# Altium project Project-C_VOLTAGE.PrjPCB (part 3 of 6)
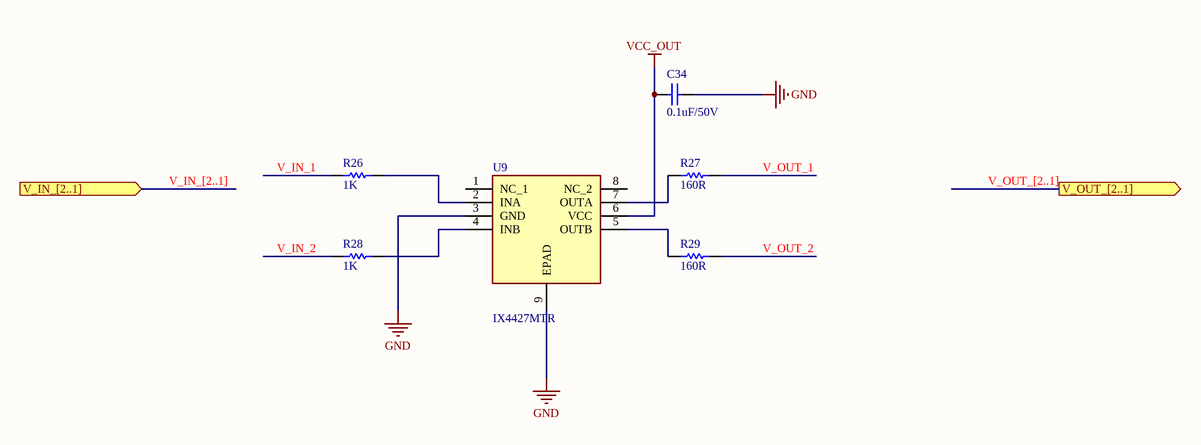
[diagram p10: VoltageAmplifier.SchDoc]
## Nets that join several sheets
GND: TOP_VOLTAGE (26 pins), F1/IO (19 pins), F1/POWER (42 pins), VoltageHeaders (20 pins), POWER_VOLTAGE (32 pins), F2/IO (19 pins), F2/POWER (42 pins), F3/IO (19 pins), F3/POWER (42 pins), F4/IO (19 pins), F4/POWER (42 pins), Power_ORing (14 pins), U_VoltageAmplifier_1xFPGA1/U_VoltageAmplifier1 (C34_U_VoltageAmplifier_1xFPGA1_U_VoltageAmplifier1.2 U9_U_VoltageAmplifier_1xFPGA1_U_VoltageAmplifier1.3 U9_U_VoltageAmplifier_1xFPGA1_U_VoltageAmplifier1.9), U_VoltageAmplifier_1xFPGA1/U_VoltageAmplifier2 (C34_U_VoltageAmplifier_1xFPGA1_U_VoltageAmplifier2.2 U9_U_VoltageAmplifier_1xFPGA1_U_VoltageAmplifier2.3 U9_U_VoltageAmplifier_1xFPGA1_U_VoltageAmplifier2.9), U_VoltageAmplifier_1xFPGA1/U_VoltageAmplifier3 (C34_U_VoltageAmplifier_1xFPGA1_U_VoltageAmplifier3.2 U9_U_VoltageAmplifier_1xFPGA1_U_VoltageAmplifier3.3 U9_U_VoltageAmplifier_1xFPGA1_U_VoltageAmplifier3.9), U_VoltageAmplifier_1xFPGA1/U_VoltageAmplifier4 (C34_U_VoltageAmplifier_1xFPGA1_U_VoltageAmplifier4.2 U9_U_VoltageAmplifier_1xFPGA1_U_VoltageAmplifier4.3 U9_U_VoltageAmplifier_1xFPGA1_U_VoltageAmplifier4.9), U_VoltageAmplifier_1xFPGA1/U_VoltageAmplifier5 (C34_U_VoltageAmplifier_1xFPGA1_U_VoltageAmplifier5.2 U9_U_VoltageAmplifier_1xFPGA1_U_VoltageAmplifier5.3 U9_U_VoltageAmplifier_1xFPGA1_U_VoltageAmplifier5.9), U_VoltageAmplifier_1xFPGA1/U_VoltageAmplifier6 (C34_U_VoltageAmplifier_1xFPGA1_U_VoltageAmplifier6.2 U9_U_VoltageAmplifier_1xFPGA1_U_VoltageAmplifier6.3 U9_U_VoltageAmplifier_1xFPGA1_U_VoltageAmplifier6.9), U_VoltageAmplifier_1xFPGA1/U_VoltageAmplifier7 (C34_U_VoltageAmplifier_1xFPGA1_U_VoltageAmplifier7.2 U9_U_VoltageAmplifier_1xFPGA1_U_VoltageAmplifier7.3 U9_U_VoltageAmplifier_1xFPGA1_U_VoltageAmplifier7.9), U_VoltageAmplifier_1xFPGA1/U_VoltageAmplifier8 (C34_U_VoltageAmplifier_1xFPGA1_U_VoltageAmplifier8.2 U9_U_VoltageAmplifier_1xFPGA1_U_VoltageAmplifier8.3 U9_U_VoltageAmplifier_1xFPGA1_U_VoltageAmplifier8.9), U_VoltageAmplifier_1xFPGA1/U_VoltageAmplifier9 (C34_U_VoltageAmplifier_1xFPGA1_U_VoltageAmplifier9.2 U9_U_VoltageAmplifier_1xFPGA1_U_VoltageAmplifier9.3 U9_U_VoltageAmplifier_1xFPGA1_U_VoltageAmplifier9.9), U_VoltageAmplifier_1xFPGA1/U_VoltageAmplifier10 (C34_U_VoltageAmplifier_1xFPGA1_U_VoltageAmplifier10.2 U9_U_VoltageAmplifier_1xFPGA1_U_VoltageAmplifier10.3 U9_U_VoltageAmplifier_1xFPGA1_U_VoltageAmplifier10.9), U_VoltageAmplifier_1xFPGA1/U_VoltageAmplifier11 (C34_U_VoltageAmplifier_1xFPGA1_U_VoltageAmplifier11.2 U9_U_VoltageAmplifier_1xFPGA1_U_VoltageAmplifier11.3 U9_U_VoltageAmplifier_1xFPGA1_U_VoltageAmplifier11.9), U_VoltageAmplifier_1xFPGA1/U_VoltageAmplifier12 (C34_U_VoltageAmplifier_1xFPGA1_U_VoltageAmplifier12.2 U9_U_VoltageAmplifier_1xFPGA1_U_VoltageAmplifier12.3 U9_U_VoltageAmplifier_1xFPGA1_U_VoltageAmplifier12.9), U_VoltageAmplifier_1xFPGA1/U_VoltageAmplifier13 (C34_U_VoltageAmplifier_1xFPGA1_U_VoltageAmplifier13.2 U9_U_VoltageAmplifier_1xFPGA1_U_VoltageAmplifier13.3 U9_U_VoltageAmplifier_1xFPGA1_U_VoltageAmplifier13.9), U_VoltageAmplifier_1xFPGA1/U_VoltageAmplifier14 (C34_U_VoltageAmplifier_1xFPGA1_U_VoltageAmplifier14.2 U9_U_VoltageAmplifier_1xFPGA1_U_VoltageAmplifier14.3 U9_U_VoltageAmplifier_1xFPGA1_U_VoltageAmplifier14.9), U_VoltageAmplifier_1xFPGA1/U_VoltageAmplifier15 (C34_U_VoltageAmplifier_1xFPGA1_U_VoltageAmplifier15.2 U9_U_VoltageAmplifier_1xFPGA1_U_VoltageAmplifier15.3 U9_U_VoltageAmplifier_1xFPGA1_U_VoltageAmplifier15.9), U_VoltageAmplifier_1xFPGA1/U_VoltageAmplifier16 (C34_U_VoltageAmplifier_1xFPGA1_U_VoltageAmplifier16.2 U9_U_VoltageAmplifier_1xFPGA1_U_VoltageAmplifier16.3 U9_U_VoltageAmplifier_1xFPGA1_U_VoltageAmplifier16.9), U_VoltageAmplifier_1xFPGA1/U_VoltageAmplifier17 (C34_U_VoltageAmplifier_1xFPGA1_U_VoltageAmplifier17.2 U9_U_VoltageAmplifier_1xFPGA1_U_VoltageAmplifier17.3 U9_U_VoltageAmplifier_1xFPGA1_U_VoltageAmplifier17.9), U_VoltageAmplifier_1xFPGA1/U_VoltageAmplifier18 (C34_U_VoltageAmplifier_1xFPGA1_U_VoltageAmplifier18.2 U9_U_VoltageAmplifier_1xFPGA1_U_VoltageAmplifier18.3 U9_U_VoltageAmplifier_1xFPGA1_U_VoltageAmplifier18.9), U_VoltageAmplifier_1xFPGA1/U_VoltageAmplifier19 (C34_U_VoltageAmplifier_1xFPGA1_U_VoltageAmplifier19.2 U9_U_VoltageAmplifier_1xFPGA1_U_VoltageAmplifier19.3 U9_U_VoltageAmplifier_1xFPGA1_U_VoltageAmplifier19.9), U_VoltageAmplifier_1xFPGA1/U_VoltageAmplifier20 (C34_U_VoltageAmplifier_1xFPGA1_U_VoltageAmplifier20.2 U9_U_VoltageAmplifier_1xFPGA1_U_VoltageAmplifier20.3 U9_U_VoltageAmplifier_1xFPGA1_U_VoltageAmplifier20.9), U_VoltageAmplifier_1xFPGA1/U_VoltageAmplifier21 (C34_U_VoltageAmplifier_1xFPGA1_U_VoltageAmplifier21.2 U9_U_VoltageAmplifier_1xFPGA1_U_VoltageAmplifier21.3 U9_U_VoltageAmplifier_1xFPGA1_U_VoltageAmplifier21.9), U_VoltageAmplifier_1xFPGA1/U_VoltageAmplifier22 (C34_U_VoltageAmplifier_1xFPGA1_U_VoltageAmplifier22.2 U9_U_VoltageAmplifier_1xFPGA1_U_VoltageAmplifier22.3 U9_U_VoltageAmplifier_1xFPGA1_U_VoltageAmplifier22.9), U_VoltageAmplifier_1xFPGA1/U_VoltageAmplifier23 (C34_U_VoltageAmplifier_1xFPGA1_U_VoltageAmplifier23.2 U9_U_VoltageAmplifier_1xFPGA1_U_VoltageAmplifier23.3 U9_U_VoltageAmplifier_1xFPGA1_U_VoltageAmplifier23.9), U_VoltageAmplifier_1xFPGA1/U_VoltageAmplifier24 (C34_U_VoltageAmplifier_1xFPGA1_U_VoltageAmplifier24.2 U9_U_VoltageAmplifier_1xFPGA1_U_VoltageAmplifier24.3 U9_U_VoltageAmplifier_1xFPGA1_U_VoltageAmplifier24.9), U_VoltageAmplifier_1xFPGA1/U_VoltageAmplifier25 (C34_U_VoltageAmplifier_1xFPGA1_U_VoltageAmplifier25.2 U9_U_VoltageAmplifier_1xFPGA1_U_VoltageAmplifier25.3 U9_U_VoltageAmplifier_1xFPGA1_U_VoltageAmplifier25.9), U_VoltageAmplifier_1xFPGA1/U_VoltageAmplifier26 (C34_U_VoltageAmplifier_1xFPGA1_U_VoltageAmplifier26.2 U9_U_VoltageAmplifier_1xFPGA1_U_VoltageAmplifier26.3 U9_U_VoltageAmplifier_1xFPGA1_U_VoltageAmplifier26.9), U_VoltageAmplifier_1xFPGA1/U_VoltageAmplifier27 (C34_U_VoltageAmplifier_1xFPGA1_U_VoltageAmplifier27.2 U9_U_VoltageAmplifier_1xFPGA1_U_VoltageAmplifier27.3 U9_U_VoltageAmplifier_1xFPGA1_U_VoltageAmplifier27.9), U_VoltageAmplifier_1xFPGA1/U_VoltageAmplifier28 (C34_U_VoltageAmplifier_1xFPGA1_U_VoltageAmplifier28.2 U9_U_VoltageAmplifier_1xFPGA1_U_VoltageAmplifier28.3 U9_U_VoltageAmplifier_1xFPGA1_U_VoltageAmplifier28.9), U_VoltageAmplifier_1xFPGA1/U_VoltageAmplifier29 (C34_U_VoltageAmplifier_1xFPGA1_U_VoltageAmplifier29.2 U9_U_VoltageAmplifier_1xFPGA1_U_VoltageAmplifier29.3 U9_U_VoltageAmplifier_1xFPGA1_U_VoltageAmplifier29.9), U_VoltageAmplifier_1xFPGA1/U_VoltageAmplifier30 (C34_U_VoltageAmplifier_1xFPGA1_U_VoltageAmplifier30.2 U9_U_VoltageAmplifier_1xFPGA1_U_VoltageAmplifier30.3 U9_U_VoltageAmplifier_1xFPGA1_U_VoltageAmplifier30.9), U_VoltageAmplifier_1xFPGA1/U_VoltageAmplifier31 (C34_U_VoltageAmplifier_1xFPGA1_U_VoltageAmplifier31.2 U9_U_VoltageAmplifier_1xFPGA1_U_VoltageAmplifier31.3 U9_U_VoltageAmplifier_1xFPGA1_U_VoltageAmplifier31.9), U_VoltageAmplifier_1xFPGA1/U_VoltageAmplifier32 (C34_U_VoltageAmplifier_1xFPGA1_U_VoltageAmplifier32.2 U9_U_VoltageAmplifier_1xFPGA1_U_VoltageAmplifier32.3 U9_U_VoltageAmplifier_1xFPGA1_U_VoltageAmplifier32.9), U_VoltageAmplifier_1xFPGA1/U_VoltageAmplifier33 (C34_U_VoltageAmplifier_1xFPGA1_U_VoltageAmplifier33.2 U9_U_VoltageAmplifier_1xFPGA1_U_VoltageAmplifier33.3 U9_U_VoltageAmplifier_1xFPGA1_U_VoltageAmplifier33.9), U_VoltageAmplifier_1xFPGA1/U_VoltageAmplifier34 (C34_U_VoltageAmplifier_1xFPGA1_U_VoltageAmplifier34.2 U9_U_VoltageAmplifier_1xFPGA1_U_VoltageAmplifier34.3 U9_U_VoltageAmplifier_1xFPGA1_U_VoltageAmplifier34.9), U_VoltageAmplifier_1xFPGA1/U_VoltageAmplifier35 (C34_U_VoltageAmplifier_1xFPGA1_U_VoltageAmplifier35.2 U9_U_VoltageAmplifier_1xFPGA1_U_VoltageAmplifier35.3 U9_U_VoltageAmplifier_1xFPGA1_U_VoltageAmplifier35.9), U_VoltageAmplifier_1xFPGA1/U_VoltageAmplifier36 (C34_U_VoltageAmplifier_1xFPGA1_U_VoltageAmplifier36.2 U9_U_VoltageAmplifier_1xFPGA1_U_VoltageAmplifier36.3 U9_U_VoltageAmplifier_1xFPGA1_U_VoltageAmplifier36.9), U_VoltageAmplifier_1xFPGA1/U_VoltageAmplifier37 (C34_U_VoltageAmplifier_1xFPGA1_U_VoltageAmplifier37.2 U9_U_VoltageAmplifier_1xFPGA1_U_VoltageAmplifier37.3 U9_U_VoltageAmplifier_1xFPGA1_U_VoltageAmplifier37.9), U_VoltageAmplifier_1xFPGA1/U_VoltageAmplifier38 (C34_U_VoltageAmplifier_1xFPGA1_U_VoltageAmplifier38.2 U9_U_VoltageAmplifier_1xFPGA1_U_VoltageAmplifier38.3 U9_U_VoltageAmplifier_1xFPGA1_U_VoltageAmplifier38.9), U_VoltageAmplifier_1xFPGA2/U_VoltageAmplifier1 (C34_U_VoltageAmplifier_1xFPGA2_U_VoltageAmplifier1.2 U9_U_VoltageAmplifier_1xFPGA2_U_VoltageAmplifier1.3 U9_U_VoltageAmplifier_1xFPGA2_U_VoltageAmplifier1.9), U_VoltageAmplifier_1xFPGA2/U_VoltageAmplifier2 (C34_U_VoltageAmplifier_1xFPGA2_U_VoltageAmplifier2.2 U9_U_VoltageAmplifier_1xFPGA2_U_VoltageAmplifier2.3 U9_U_VoltageAmplifier_1xFPGA2_U_VoltageAmplifier2.9), U_VoltageAmplifier_1xFPGA2/U_VoltageAmplifier3 (C34_U_VoltageAmplifier_1xFPGA2_U_VoltageAmplifier3.2 U9_U_VoltageAmplifier_1xFPGA2_U_VoltageAmplifier3.3 U9_U_VoltageAmplifier_1xFPGA2_U_VoltageAmplifier3.9), U_VoltageAmplifier_1xFPGA2/U_VoltageAmplifier4 (C34_U_VoltageAmplifier_1xFPGA2_U_VoltageAmplifier4.2 U9_U_VoltageAmplifier_1xFPGA2_U_VoltageAmplifier4.3 U9_U_VoltageAmplifier_1xFPGA2_U_VoltageAmplifier4.9), U_VoltageAmplifier_1xFPGA2/U_VoltageAmplifier5 (C34_U_VoltageAmplifier_1xFPGA2_U_VoltageAmplifier5.2 U9_U_VoltageAmplifier_1xFPGA2_U_VoltageAmplifier5.3 U9_U_VoltageAmplifier_1xFPGA2_U_VoltageAmplifier5.9), U_VoltageAmplifier_1xFPGA2/U_VoltageAmplifier6 (C34_U_VoltageAmplifier_1xFPGA2_U_VoltageAmplifier6.2 U9_U_VoltageAmplifier_1xFPGA2_U_VoltageAmplifier6.3 U9_U_VoltageAmplifier_1xFPGA2_U_VoltageAmplifier6.9), U_VoltageAmplifier_1xFPGA2/U_VoltageAmplifier7 (C34_U_VoltageAmplifier_1xFPGA2_U_VoltageAmplifier7.2 U9_U_VoltageAmplifier_1xFPGA2_U_VoltageAmplifier7.3 U9_U_VoltageAmplifier_1xFPGA2_U_VoltageAmplifier7.9), U_VoltageAmplifier_1xFPGA2/U_VoltageAmplifier8 (C34_U_VoltageAmplifier_1xFPGA2_U_VoltageAmplifier8.2 U9_U_VoltageAmplifier_1xFPGA2_U_VoltageAmplifier8.3 U9_U_VoltageAmplifier_1xFPGA2_U_VoltageAmplifier8.9), U_VoltageAmplifier_1xFPGA2/U_VoltageAmplifier9 (C34_U_VoltageAmplifier_1xFPGA2_U_VoltageAmplifier9.2 U9_U_VoltageAmplifier_1xFPGA2_U_VoltageAmplifier9.3 U9_U_VoltageAmplifier_1xFPGA2_U_VoltageAmplifier9.9), U_VoltageAmplifier_1xFPGA2/U_VoltageAmplifier10 (C34_U_VoltageAmplifier_1xFPGA2_U_VoltageAmplifier10.2 U9_U_VoltageAmplifier_1xFPGA2_U_VoltageAmplifier10.3 U9_U_VoltageAmplifier_1xFPGA2_U_VoltageAmplifier10.9), U_VoltageAmplifier_1xFPGA2/U_VoltageAmplifier11 (C34_U_VoltageAmplifier_1xFPGA2_U_VoltageAmplifier11.2 U9_U_VoltageAmplifier_1xFPGA2_U_VoltageAmplifier11.3 U9_U_VoltageAmplifier_1xFPGA2_U_VoltageAmplifier11.9), U_VoltageAmplifier_1xFPGA2/U_VoltageAmplifier12 (C34_U_VoltageAmplifier_1xFPGA2_U_VoltageAmplifier12.2 U9_U_VoltageAmplifier_1xFPGA2_U_VoltageAmplifier12.3 U9_U_VoltageAmplifier_1xFPGA2_U_VoltageAmplifier12.9), U_VoltageAmplifier_1xFPGA2/U_VoltageAmplifier13 (C34_U_VoltageAmplifier_1xFPGA2_U_VoltageAmplifier13.2 U9_U_VoltageAmplifier_1xFPGA2_U_VoltageAmplifier13.3 U9_U_VoltageAmplifier_1xFPGA2_U_VoltageAmplifier13.9), U_VoltageAmplifier_1xFPGA2/U_VoltageAmplifier14 (C34_U_VoltageAmplifier_1xFPGA2_U_VoltageAmplifier14.2 U9_U_VoltageAmplifier_1xFPGA2_U_VoltageAmplifier14.3 U9_U_VoltageAmplifier_1xFPGA2_U_VoltageAmplifier14.9), U_VoltageAmplifier_1xFPGA2/U_VoltageAmplifier15 (C34_U_VoltageAmplifier_1xFPGA2_U_VoltageAmplifier15.2 U9_U_VoltageAmplifier_1xFPGA2_U_VoltageAmplifier15.3 U9_U_VoltageAmplifier_1xFPGA2_U_VoltageAmplifier15.9), U_VoltageAmplifier_1xFPGA2/U_VoltageAmplifier16 (C34_U_VoltageAmplifier_1xFPGA2_U_VoltageAmplifier16.2 U9_U_VoltageAmplifier_1xFPGA2_U_VoltageAmplifier16.3 U9_U_VoltageAmplifier_1xFPGA2_U_VoltageAmplifier16.9), U_VoltageAmplifier_1xFPGA2/U_VoltageAmplifier17 (C34_U_VoltageAmplifier_1xFPGA2_U_VoltageAmplifier17.2 U9_U_VoltageAmplifier_1xFPGA2_U_VoltageAmplifier17.3 U9_U_VoltageAmplifier_1xFPGA2_U_VoltageAmplifier17.9), U_VoltageAmplifier_1xFPGA2/U_VoltageAmplifier18 (C34_U_VoltageAmplifier_1xFPGA2_U_VoltageAmplifier18.2 U9_U_VoltageAmplifier_1xFPGA2_U_VoltageAmplifier18.3 U9_U_VoltageAmplifier_1xFPGA2_U_VoltageAmplifier18.9), U_VoltageAmplifier_1xFPGA2/U_VoltageAmplifier19 (C34_U_VoltageAmplifier_1xFPGA2_U_VoltageAmplifier19.2 U9_U_VoltageAmplifier_1xFPGA2_U_VoltageAmplifier19.3 U9_U_VoltageAmplifier_1xFPGA2_U_VoltageAmplifier19.9), U_VoltageAmplifier_1xFPGA2/U_VoltageAmplifier20 (C34_U_VoltageAmplifier_1xFPGA2_U_VoltageAmplifier20.2 U9_U_VoltageAmplifier_1xFPGA2_U_VoltageAmplifier20.3 U9_U_VoltageAmplifier_1xFPGA2_U_VoltageAmplifier20.9), U_VoltageAmplifier_1xFPGA2/U_VoltageAmplifier21 (C34_U_VoltageAmplifier_1xFPGA2_U_VoltageAmplifier21.2 U9_U_VoltageAmplifier_1xFPGA2_U_VoltageAmplifier21.3 U9_U_VoltageAmplifier_1xFPGA2_U_VoltageAmplifier21.9), U_VoltageAmplifier_1xFPGA2/U_VoltageAmplifier22 (C34_U_VoltageAmplifier_1xFPGA2_U_VoltageAmplifier22.2 U9_U_VoltageAmplifier_1xFPGA2_U_VoltageAmplifier22.3 U9_U_VoltageAmplifier_1xFPGA2_U_VoltageAmplifier22.9), U_VoltageAmplifier_1xFPGA2/U_VoltageAmplifier23 (C34_U_VoltageAmplifier_1xFPGA2_U_VoltageAmplifier23.2 U9_U_VoltageAmplifier_1xFPGA2_U_VoltageAmplifier23.3 U9_U_VoltageAmplifier_1xFPGA2_U_VoltageAmplifier23.9), U_VoltageAmplifier_1xFPGA2/U_VoltageAmplifier24 (C34_U_VoltageAmplifier_1xFPGA2_U_VoltageAmplifier24.2 U9_U_VoltageAmplifier_1xFPGA2_U_VoltageAmplifier24.3 U9_U_VoltageAmplifier_1xFPGA2_U_VoltageAmplifier24.9), U_VoltageAmplifier_1xFPGA2/U_VoltageAmplifier25 (C34_U_VoltageAmplifier_1xFPGA2_U_VoltageAmplifier25.2 U9_U_VoltageAmplifier_1xFPGA2_U_VoltageAmplifier25.3 U9_U_VoltageAmplifier_1xFPGA2_U_VoltageAmplifier25.9), U_VoltageAmplifier_1xFPGA2/U_VoltageAmplifier26 (C34_U_VoltageAmplifier_1xFPGA2_U_VoltageAmplifier26.2 U9_U_VoltageAmplifier_1xFPGA2_U_VoltageAmplifier26.3 U9_U_VoltageAmplifier_1xFPGA2_U_VoltageAmplifier26.9), U_VoltageAmplifier_1xFPGA2/U_VoltageAmplifier27 (C34_U_VoltageAmplifier_1xFPGA2_U_VoltageAmplifier27.2 U9_U_VoltageAmplifier_1xFPGA2_U_VoltageAmplifier27.3 U9_U_VoltageAmplifier_1xFPGA2_U_VoltageAmplifier27.9), U_VoltageAmplifier_1xFPGA2/U_VoltageAmplifier28 (C34_U_VoltageAmplifier_1xFPGA2_U_VoltageAmplifier28.2 U9_U_VoltageAmplifier_1xFPGA2_U_VoltageAmplifier28.3 U9_U_VoltageAmplifier_1xFPGA2_U_VoltageAmplifier28.9), U_VoltageAmplifier_1xFPGA2/U_VoltageAmplifier29 (C34_U_VoltageAmplifier_1xFPGA2_U_VoltageAmplifier29.2 U9_U_VoltageAmplifier_1xFPGA2_U_VoltageAmplifier29.3 U9_U_VoltageAmplifier_1xFPGA2_U_VoltageAmplifier29.9), U_VoltageAmplifier_1xFPGA2/U_VoltageAmplifier30 (C34_U_VoltageAmplifier_1xFPGA2_U_VoltageAmplifier30.2 U9_U_VoltageAmplifier_1xFPGA2_U_VoltageAmplifier30.3 U9_U_VoltageAmplifier_1xFPGA2_U_VoltageAmplifier30.9), U_VoltageAmplifier_1xFPGA2/U_VoltageAmplifier31 (C34_U_VoltageAmplifier_1xFPGA2_U_VoltageAmplifier31.2 U9_U_VoltageAmplifier_1xFPGA2_U_VoltageAmplifier31.3 U9_U_VoltageAmplifier_1xFPGA2_U_VoltageAmplifier31.9), U_VoltageAmplifier_1xFPGA2/U_VoltageAmplifier32 (C34_U_VoltageAmplifier_1xFPGA2_U_VoltageAmplifier32.2 U9_U_VoltageAmplifier_1xFPGA2_U_VoltageAmplifier32.3 U9_U_VoltageAmplifier_1xFPGA2_U_VoltageAmplifier32.9), U_VoltageAmplifier_1xFPGA2/U_VoltageAmplifier33 (C34_U_VoltageAmplifier_1xFPGA2_U_VoltageAmplifier33.2 U9_U_VoltageAmplifier_1xFPGA2_U_VoltageAmplifier33.3 U9_U_VoltageAmplifier_1xFPGA2_U_VoltageAmplifier33.9), U_VoltageAmplifier_1xFPGA2/U_VoltageAmplifier34 (C34_U_VoltageAmplifier_1xFPGA2_U_VoltageAmplifier34.2 U9_U_VoltageAmplifier_1xFPGA2_U_VoltageAmplifier34.3 U9_U_VoltageAmplifier_1xFPGA2_U_VoltageAmplifier34.9), U_VoltageAmplifier_1xFPGA2/U_VoltageAmplifier35 (C34_U_VoltageAmplifier_1xFPGA2_U_VoltageAmplifier35.2 U9_U_VoltageAmplifier_1xFPGA2_U_VoltageAmplifier35.3 U9_U_VoltageAmplifier_1xFPGA2_U_VoltageAmplifier35.9), U_VoltageAmplifier_1xFPGA2/U_VoltageAmplifier36 (C34_U_VoltageAmplifier_1xFPGA2_U_VoltageAmplifier36.2 U9_U_VoltageAmplifier_1xFPGA2_U_VoltageAmplifier36.3 U9_U_VoltageAmplifier_1xFPGA2_U_VoltageAmplifier36.9), U_VoltageAmplifier_1xFPGA2/U_VoltageAmplifier37 (C34_U_VoltageAmplifier_1xFPGA2_U_VoltageAmplifier37.2 U9_U_VoltageAmplifier_1xFPGA2_U_VoltageAmplifier37.3 U9_U_VoltageAmplifier_1xFPGA2_U_VoltageAmplifier37.9), U_VoltageAmplifier_1xFPGA2/U_VoltageAmplifier38 (C34_U_VoltageAmplifier_1xFPGA2_U_VoltageAmplifier38.2 U9_U_VoltageAmplifier_1xFPGA2_U_VoltageAmplifier38.3 U9_U_VoltageAmplifier_1xFPGA2_U_VoltageAmplifier38.9), U_VoltageAmplifier_1xFPGA3/U_VoltageAmplifier1 (C34_U_VoltageAmplifier_1xFPGA3_U_VoltageAmplifier1.2 U9_U_VoltageAmplifier_1xFPGA3_U_VoltageAmplifier1.3 U9_U_VoltageAmplifier_1xFPGA3_U_VoltageAmplifier1.9), U_VoltageAmplifier_1xFPGA3/U_VoltageAmplifier2 (C34_U_VoltageAmplifier_1xFPGA3_U_VoltageAmplifier2.2 U9_U_VoltageAmplifier_1xFPGA3_U_VoltageAmplifier2.3 U9_U_VoltageAmplifier_1xFPGA3_U_VoltageAmplifier2.9), U_VoltageAmplifier_1xFPGA3/U_VoltageAmplifier3 (C34_U_VoltageAmplifier_1xFPGA3_U_VoltageAmplifier3.2 U9_U_VoltageAmplifier_1xFPGA3_U_VoltageAmplifier3.3 U9_U_VoltageAmplifier_1xFPGA3_U_VoltageAmplifier3.9), U_VoltageAmplifier_1xFPGA3/U_VoltageAmplifier4 (C34_U_VoltageAmplifier_1xFPGA3_U_VoltageAmplifier4.2 U9_U_VoltageAmplifier_1xFPGA3_U_VoltageAmplifier4.3 U9_U_VoltageAmplifier_1xFPGA3_U_VoltageAmplifier4.9), U_VoltageAmplifier_1xFPGA3/U_VoltageAmplifier5 (C34_U_VoltageAmplifier_1xFPGA3_U_VoltageAmplifier5.2 U9_U_VoltageAmplifier_1xFPGA3_U_VoltageAmplifier5.3 U9_U_VoltageAmplifier_1xFPGA3_U_VoltageAmplifier5.9), U_VoltageAmplifier_1xFPGA3/U_VoltageAmplifier6 (C34_U_VoltageAmplifier_1xFPGA3_U_VoltageAmplifier6.2 U9_U_VoltageAmplifier_1xFPGA3_U_VoltageAmplifier6.3 U9_U_VoltageAmplifier_1xFPGA3_U_VoltageAmplifier6.9), U_VoltageAmplifier_1xFPGA3/U_VoltageAmplifier7 (C34_U_VoltageAmplifier_1xFPGA3_U_VoltageAmplifier7.2 U9_U_VoltageAmplifier_1xFPGA3_U_VoltageAmplifier7.3 U9_U_VoltageAmplifier_1xFPGA3_U_VoltageAmplifier7.9), U_VoltageAmplifier_1xFPGA3/U_VoltageAmplifier8 (C34_U_VoltageAmplifier_1xFPGA3_U_VoltageAmplifier8.2 U9_U_VoltageAmplifier_1xFPGA3_U_VoltageAmplifier8.3 U9_U_VoltageAmplifier_1xFPGA3_U_VoltageAmplifier8.9), U_VoltageAmplifier_1xFPGA3/U_VoltageAmplifier9 (C34_U_VoltageAmplifier_1xFPGA3_U_VoltageAmplifier9.2 U9_U_VoltageAmplifier_1xFPGA3_U_VoltageAmplifier9.3 U9_U_VoltageAmplifier_1xFPGA3_U_VoltageAmplifier9.9), U_VoltageAmplifier_1xFPGA3/U_VoltageAmplifier10 (C34_U_VoltageAmplifier_1xFPGA3_U_VoltageAmplifier10.2 U9_U_VoltageAmplifier_1xFPGA3_U_VoltageAmplifier10.3 U9_U_VoltageAmplifier_1xFPGA3_U_VoltageAmplifier10.9), U_VoltageAmplifier_1xFPGA3/U_VoltageAmplifier11 (C34_U_VoltageAmplifier_1xFPGA3_U_VoltageAmplifier11.2 U9_U_VoltageAmplifier_1xFPGA3_U_VoltageAmplifier11.3 U9_U_VoltageAmplifier_1xFPGA3_U_VoltageAmplifier11.9), U_VoltageAmplifier_1xFPGA3/U_VoltageAmplifier12 (C34_U_VoltageAmplifier_1xFPGA3_U_VoltageAmplifier12.2 U9_U_VoltageAmplifier_1xFPGA3_U_VoltageAmplifier12.3 U9_U_VoltageAmplifier_1xFPGA3_U_VoltageAmplifier12.9), U_VoltageAmplifier_1xFPGA3/U_VoltageAmplifier13 (C34_U_VoltageAmplifier_1xFPGA3_U_VoltageAmplifier13.2 U9_U_VoltageAmplifier_1xFPGA3_U_VoltageAmplifier13.3 U9_U_VoltageAmplifier_1xFPGA3_U_VoltageAmplifier13.9), U_VoltageAmplifier_1xFPGA3/U_VoltageAmplifier14 (C34_U_VoltageAmplifier_1xFPGA3_U_VoltageAmplifier14.2 U9_U_VoltageAmplifier_1xFPGA3_U_VoltageAmplifier14.3 U9_U_VoltageAmplifier_1xFPGA3_U_VoltageAmplifier14.9), U_VoltageAmplifier_1xFPGA3/U_VoltageAmplifier15 (C34_U_VoltageAmplifier_1xFPGA3_U_VoltageAmplifier15.2 U9_U_VoltageAmplifier_1xFPGA3_U_VoltageAmplifier15.3 U9_U_VoltageAmplifier_1xFPGA3_U_VoltageAmplifier15.9), U_VoltageAmplifier_1xFPGA3/U_VoltageAmplifier16 (C34_U_VoltageAmplifier_1xFPGA3_U_VoltageAmplifier16.2 U9_U_VoltageAmplifier_1xFPGA3_U_VoltageAmplifier16.3 U9_U_VoltageAmplifier_1xFPGA3_U_VoltageAmplifier16.9), U_VoltageAmplifier_1xFPGA3/U_VoltageAmplifier17 (C34_U_VoltageAmplifier_1xFPGA3_U_VoltageAmplifier17.2 U9_U_VoltageAmplifier_1xFPGA3_U_VoltageAmplifier17.3 U9_U_VoltageAmplifier_1xFPGA3_U_VoltageAmplifier17.9), U_VoltageAmplifier_1xFPGA3/U_VoltageAmplifier18 (C34_U_VoltageAmplifier_1xFPGA3_U_VoltageAmplifier18.2 U9_U_VoltageAmplifier_1xFPGA3_U_VoltageAmplifier18.3 U9_U_VoltageAmplifier_1xFPGA3_U_VoltageAmplifier18.9), U_VoltageAmplifier_1xFPGA3/U_VoltageAmplifier19 (C34_U_VoltageAmplifier_1xFPGA3_U_VoltageAmplifier19.2 U9_U_VoltageAmplifier_1xFPGA3_U_VoltageAmplifier19.3 U9_U_VoltageAmplifier_1xFPGA3_U_VoltageAmplifier19.9), U_VoltageAmplifier_1xFPGA3/U_VoltageAmplifier20 (C34_U_VoltageAmplifier_1xFPGA3_U_VoltageAmplifier20.2 U9_U_VoltageAmplifier_1xFPGA3_U_VoltageAmplifier20.3 U9_U_VoltageAmplifier_1xFPGA3_U_VoltageAmplifier20.9), U_VoltageAmplifier_1xFPGA3/U_VoltageAmplifier21 (C34_U_VoltageAmplifier_1xFPGA3_U_VoltageAmplifier21.2 U9_U_VoltageAmplifier_1xFPGA3_U_VoltageAmplifier21.3 U9_U_VoltageAmplifier_1xFPGA3_U_VoltageAmplifier21.9), U_VoltageAmplifier_1xFPGA3/U_VoltageAmplifier22 (C34_U_VoltageAmplifier_1xFPGA3_U_VoltageAmplifier22.2 U9_U_VoltageAmplifier_1xFPGA3_U_VoltageAmplifier22.3 U9_U_VoltageAmplifier_1xFPGA3_U_VoltageAmplifier22.9), U_VoltageAmplifier_1xFPGA3/U_VoltageAmplifier23 (C34_U_VoltageAmplifier_1xFPGA3_U_VoltageAmplifier23.2 U9_U_VoltageAmplifier_1xFPGA3_U_VoltageAmplifier23.3 U9_U_VoltageAmplifier_1xFPGA3_U_VoltageAmplifier23.9), U_VoltageAmplifier_1xFPGA3/U_VoltageAmplifier24 (C34_U_VoltageAmplifier_1xFPGA3_U_VoltageAmplifier24.2 U9_U_VoltageAmplifier_1xFPGA3_U_VoltageAmplifier24.3 U9_U_VoltageAmplifier_1xFPGA3_U_VoltageAmplifier24.9), U_VoltageAmplifier_1xFPGA3/U_VoltageAmplifier25 (C34_U_VoltageAmplifier_1xFPGA3_U_VoltageAmplifier25.2 U9_U_VoltageAmplifier_1xFPGA3_U_VoltageAmplifier25.3 U9_U_VoltageAmplifier_1xFPGA3_U_VoltageAmplifier25.9), U_VoltageAmplifier_1xFPGA3/U_VoltageAmplifier26 (C34_U_VoltageAmplifier_1xFPGA3_U_VoltageAmplifier26.2 U9_U_VoltageAmplifier_1xFPGA3_U_VoltageAmplifier26.3 U9_U_VoltageAmplifier_1xFPGA3_U_VoltageAmplifier26.9), U_VoltageAmplifier_1xFPGA3/U_VoltageAmplifier27 (C34_U_VoltageAmplifier_1xFPGA3_U_VoltageAmplifier27.2 U9_U_VoltageAmplifier_1xFPGA3_U_VoltageAmplifier27.3 U9_U_VoltageAmplifier_1xFPGA3_U_VoltageAmplifier27.9), U_VoltageAmplifier_1xFPGA3/U_VoltageAmplifier28 (C34_U_VoltageAmplifier_1xFPGA3_U_VoltageAmplifier28.2 U9_U_VoltageAmplifier_1xFPGA3_U_VoltageAmplifier28.3 U9_U_VoltageAmplifier_1xFPGA3_U_VoltageAmplifier28.9), U_VoltageAmplifier_1xFPGA3/U_VoltageAmplifier29 (C34_U_VoltageAmplifier_1xFPGA3_U_VoltageAmplifier29.2 U9_U_VoltageAmplifier_1xFPGA3_U_VoltageAmplifier29.3 U9_U_VoltageAmplifier_1xFPGA3_U_VoltageAmplifier29.9), U_VoltageAmplifier_1xFPGA3/U_VoltageAmplifier30 (C34_U_VoltageAmplifier_1xFPGA3_U_VoltageAmplifier30.2 U9_U_VoltageAmplifier_1xFPGA3_U_VoltageAmplifier30.3 U9_U_VoltageAmplifier_1xFPGA3_U_VoltageAmplifier30.9), U_VoltageAmplifier_1xFPGA3/U_VoltageAmplifier31 (C34_U_VoltageAmplifier_1xFPGA3_U_VoltageAmplifier31.2 U9_U_VoltageAmplifier_1xFPGA3_U_VoltageAmplifier31.3 U9_U_VoltageAmplifier_1xFPGA3_U_VoltageAmplifier31.9), U_VoltageAmplifier_1xFPGA3/U_VoltageAmplifier32 (C34_U_VoltageAmplifier_1xFPGA3_U_VoltageAmplifier32.2 U9_U_VoltageAmplifier_1xFPGA3_U_VoltageAmplifier32.3 U9_U_VoltageAmplifier_1xFPGA3_U_VoltageAmplifier32.9), U_VoltageAmplifier_1xFPGA3/U_VoltageAmplifier33 (C34_U_VoltageAmplifier_1xFPGA3_U_VoltageAmplifier33.2 U9_U_VoltageAmplifier_1xFPGA3_U_VoltageAmplifier33.3 U9_U_VoltageAmplifier_1xFPGA3_U_VoltageAmplifier33.9), U_VoltageAmplifier_1xFPGA3/U_VoltageAmplifier34 (C34_U_VoltageAmplifier_1xFPGA3_U_VoltageAmplifier34.2 U9_U_VoltageAmplifier_1xFPGA3_U_VoltageAmplifier34.3 U9_U_VoltageAmplifier_1xFPGA3_U_VoltageAmplifier34.9), U_VoltageAmplifier_1xFPGA3/U_VoltageAmplifier35 (C34_U_VoltageAmplifier_1xFPGA3_U_VoltageAmplifier35.2 U9_U_VoltageAmplifier_1xFPGA3_U_VoltageAmplifier35.3 U9_U_VoltageAmplifier_1xFPGA3_U_VoltageAmplifier35.9), U_VoltageAmplifier_1xFPGA3/U_VoltageAmplifier36 (C34_U_VoltageAmplifier_1xFPGA3_U_VoltageAmplifier36.2 U9_U_VoltageAmplifier_1xFPGA3_U_VoltageAmplifier36.3 U9_U_VoltageAmplifier_1xFPGA3_U_VoltageAmplifier36.9), U_VoltageAmplifier_1xFPGA3/U_VoltageAmplifier37 (C34_U_VoltageAmplifier_1xFPGA3_U_VoltageAmplifier37.2 U9_U_VoltageAmplifier_1xFPGA3_U_VoltageAmplifier37.3 U9_U_VoltageAmplifier_1xFPGA3_U_VoltageAmplifier37.9), U_VoltageAmplifier_1xFPGA3/U_VoltageAmplifier38 (C34_U_VoltageAmplifier_1xFPGA3_U_VoltageAmplifier38.2 U9_U_VoltageAmplifier_1xFPGA3_U_VoltageAmplifier38.3 U9_U_VoltageAmplifier_1xFPGA3_U_VoltageAmplifier38.9), U_VoltageAmplifier_1xFPGA4/U_VoltageAmplifier1 (C34_U_VoltageAmplifier_1xFPGA4_U_VoltageAmplifier1.2 U9_U_VoltageAmplifier_1xFPGA4_U_VoltageAmplifier1.3 U9_U_VoltageAmplifier_1xFPGA4_U_VoltageAmplifier1.9), U_VoltageAmplifier_1xFPGA4/U_VoltageAmplifier2 (C34_U_VoltageAmplifier_1xFPGA4_U_VoltageAmplifier2.2 U9_U_VoltageAmplifier_1xFPGA4_U_VoltageAmplifier2.3 U9_U_VoltageAmplifier_1xFPGA4_U_VoltageAmplifier2.9), U_VoltageAmplifier_1xFPGA4/U_VoltageAmplifier3 (C34_U_VoltageAmplifier_1xFPGA4_U_VoltageAmplifier3.2 U9_U_VoltageAmplifier_1xFPGA4_U_VoltageAmplifier3.3 U9_U_VoltageAmplifier_1xFPGA4_U_VoltageAmplifier3.9), U_VoltageAmplifier_1xFPGA4/U_VoltageAmplifier4 (C34_U_VoltageAmplifier_1xFPGA4_U_VoltageAmplifier4.2 U9_U_VoltageAmplifier_1xFPGA4_U_VoltageAmplifier4.3 U9_U_VoltageAmplifier_1xFPGA4_U_VoltageAmplifier4.9), U_VoltageAmplifier_1xFPGA4/U_VoltageAmplifier5 (C34_U_VoltageAmplifier_1xFPGA4_U_VoltageAmplifier5.2 U9_U_VoltageAmplifier_1xFPGA4_U_VoltageAmplifier5.3 U9_U_VoltageAmplifier_1xFPGA4_U_VoltageAmplifier5.9), U_VoltageAmplifier_1xFPGA4/U_VoltageAmplifier6 (C34_U_VoltageAmplifier_1xFPGA4_U_VoltageAmplifier6.2 U9_U_VoltageAmplifier_1xFPGA4_U_VoltageAmplifier6.3 U9_U_VoltageAmplifier_1xFPGA4_U_VoltageAmplifier6.9), U_VoltageAmplifier_1xFPGA4/U_VoltageAmplifier7 (C34_U_VoltageAmplifier_1xFPGA4_U_VoltageAmplifier7.2 U9_U_VoltageAmplifier_1xFPGA4_U_VoltageAmplifier7.3 U9_U_VoltageAmplifier_1xFPGA4_U_VoltageAmplifier7.9), U_VoltageAmplifier_1xFPGA4/U_VoltageAmplifier8 (C34_U_VoltageAmplifier_1xFPGA4_U_VoltageAmplifier8.2 U9_U_VoltageAmplifier_1xFPGA4_U_VoltageAmplifier8.3 U9_U_VoltageAmplifier_1xFPGA4_U_VoltageAmplifier8.9), U_VoltageAmplifier_1xFPGA4/U_VoltageAmplifier9 (C34_U_VoltageAmplifier_1xFPGA4_U_VoltageAmplifier9.2 U9_U_VoltageAmplifier_1xFPGA4_U_VoltageAmplifier9.3 U9_U_VoltageAmplifier_1xFPGA4_U_VoltageAmplifier9.9), U_VoltageAmplifier_1xFPGA4/U_VoltageAmplifier10 (C34_U_VoltageAmplifier_1xFPGA4_U_VoltageAmplifier10.2 U9_U_VoltageAmplifier_1xFPGA4_U_VoltageAmplifier10.3 U9_U_VoltageAmplifier_1xFPGA4_U_VoltageAmplifier10.9), U_VoltageAmplifier_1xFPGA4/U_VoltageAmplifier11 (C34_U_VoltageAmplifier_1xFPGA4_U_VoltageAmplifier11.2 U9_U_VoltageAmplifier_1xFPGA4_U_VoltageAmplifier11.3 U9_U_VoltageAmplifier_1xFPGA4_U_VoltageAmplifier11.9), U_VoltageAmplifier_1xFPGA4/U_VoltageAmplifier12 (C34_U_VoltageAmplifier_1xFPGA4_U_VoltageAmplifier12.2 U9_U_VoltageAmplifier_1xFPGA4_U_VoltageAmplifier12.3 U9_U_VoltageAmplifier_1xFPGA4_U_VoltageAmplifier12.9), U_VoltageAmplifier_1xFPGA4/U_VoltageAmplifier13 (C34_U_VoltageAmplifier_1xFPGA4_U_VoltageAmplifier13.2 U9_U_VoltageAmplifier_1xFPGA4_U_VoltageAmplifier13.3 U9_U_VoltageAmplifier_1xFPGA4_U_VoltageAmplifier13.9), U_VoltageAmplifier_1xFPGA4/U_VoltageAmplifier14 (C34_U_VoltageAmplifier_1xFPGA4_U_VoltageAmplifier14.2 U9_U_VoltageAmplifier_1xFPGA4_U_VoltageAmplifier14.3 U9_U_VoltageAmplifier_1xFPGA4_U_VoltageAmplifier14.9), U_VoltageAmplifier_1xFPGA4/U_VoltageAmplifier15 (C34_U_VoltageAmplifier_1xFPGA4_U_VoltageAmplifier15.2 U9_U_VoltageAmplifier_1xFPGA4_U_VoltageAmplifier15.3 U9_U_VoltageAmplifier_1xFPGA4_U_VoltageAmplifier15.9), U_VoltageAmplifier_1xFPGA4/U_VoltageAmplifier16 (C34_U_VoltageAmplifier_1xFPGA4_U_VoltageAmplifier16.2 U9_U_VoltageAmplifier_1xFPGA4_U_VoltageAmplifier16.3 U9_U_VoltageAmplifier_1xFPGA4_U_VoltageAmplifier16.9), U_VoltageAmplifier_1xFPGA4/U_VoltageAmplifier17 (C34_U_VoltageAmplifier_1xFPGA4_U_VoltageAmplifier17.2 U9_U_VoltageAmplifier_1xFPGA4_U_VoltageAmplifier17.3 U9_U_VoltageAmplifier_1xFPGA4_U_VoltageAmplifier17.9), U_VoltageAmplifier_1xFPGA4/U_VoltageAmplifier18 (C34_U_VoltageAmplifier_1xFPGA4_U_VoltageAmplifier18.2 U9_U_VoltageAmplifier_1xFPGA4_U_VoltageAmplifier18.3 U9_U_VoltageAmplifier_1xFPGA4_U_VoltageAmplifier18.9), U_VoltageAmplifier_1xFPGA4/U_VoltageAmplifier19 (C34_U_VoltageAmplifier_1xFPGA4_U_VoltageAmplifier19.2 U9_U_VoltageAmplifier_1xFPGA4_U_VoltageAmplifier19.3 U9_U_VoltageAmplifier_1xFPGA4_U_VoltageAmplifier19.9), U_VoltageAmplifier_1xFPGA4/U_VoltageAmplifier20 (C34_U_VoltageAmplifier_1xFPGA4_U_VoltageAmplifier20.2 U9_U_VoltageAmplifier_1xFPGA4_U_VoltageAmplifier20.3 U9_U_VoltageAmplifier_1xFPGA4_U_VoltageAmplifier20.9), U_VoltageAmplifier_1xFPGA4/U_VoltageAmplifier21 (C34_U_VoltageAmplifier_1xFPGA4_U_VoltageAmplifier21.2 U9_U_VoltageAmplifier_1xFPGA4_U_VoltageAmplifier21.3 U9_U_VoltageAmplifier_1xFPGA4_U_VoltageAmplifier21.9), U_VoltageAmplifier_1xFPGA4/U_VoltageAmplifier22 (C34_U_VoltageAmplifier_1xFPGA4_U_VoltageAmplifier22.2 U9_U_VoltageAmplifier_1xFPGA4_U_VoltageAmplifier22.3 U9_U_VoltageAmplifier_1xFPGA4_U_VoltageAmplifier22.9), U_VoltageAmplifier_1xFPGA4/U_VoltageAmplifier23 (C34_U_VoltageAmplifier_1xFPGA4_U_VoltageAmplifier23.2 U9_U_VoltageAmplifier_1xFPGA4_U_VoltageAmplifier23.3 U9_U_VoltageAmplifier_1xFPGA4_U_VoltageAmplifier23.9), U_VoltageAmplifier_1xFPGA4/U_VoltageAmplifier24 (C34_U_VoltageAmplifier_1xFPGA4_U_VoltageAmplifier24.2 U9_U_VoltageAmplifier_1xFPGA4_U_VoltageAmplifier24.3 U9_U_VoltageAmplifier_1xFPGA4_U_VoltageAmplifier24.9), U_VoltageAmplifier_1xFPGA4/U_VoltageAmplifier25 (C34_U_VoltageAmplifier_1xFPGA4_U_VoltageAmplifier25.2 U9_U_VoltageAmplifier_1xFPGA4_U_VoltageAmplifier25.3 U9_U_VoltageAmplifier_1xFPGA4_U_VoltageAmplifier25.9), U_VoltageAmplifier_1xFPGA4/U_VoltageAmplifier26 (C34_U_VoltageAmplifier_1xFPGA4_U_VoltageAmplifier26.2 U9_U_VoltageAmplifier_1xFPGA4_U_VoltageAmplifier26.3 U9_U_VoltageAmplifier_1xFPGA4_U_VoltageAmplifier26.9), U_VoltageAmplifier_1xFPGA4/U_VoltageAmplifier27 (C34_U_VoltageAmplifier_1xFPGA4_U_VoltageAmplifier27.2 U9_U_VoltageAmplifier_1xFPGA4_U_VoltageAmplifier27.3 U9_U_VoltageAmplifier_1xFPGA4_U_VoltageAmplifier27.9), U_VoltageAmplifier_1xFPGA4/U_VoltageAmplifier28 (C34_U_VoltageAmplifier_1xFPGA4_U_VoltageAmplifier28.2 U9_U_VoltageAmplifier_1xFPGA4_U_VoltageAmplifier28.3 U9_U_VoltageAmplifier_1xFPGA4_U_VoltageAmplifier28.9), U_VoltageAmplifier_1xFPGA4/U_VoltageAmplifier29 (C34_U_VoltageAmplifier_1xFPGA4_U_VoltageAmplifier29.2 U9_U_VoltageAmplifier_1xFPGA4_U_VoltageAmplifier29.3 U9_U_VoltageAmplifier_1xFPGA4_U_VoltageAmplifier29.9), U_VoltageAmplifier_1xFPGA4/U_VoltageAmplifier30 (C34_U_VoltageAmplifier_1xFPGA4_U_VoltageAmplifier30.2 U9_U_VoltageAmplifier_1xFPGA4_U_VoltageAmplifier30.3 U9_U_VoltageAmplifier_1xFPGA4_U_VoltageAmplifier30.9), U_VoltageAmplifier_1xFPGA4/U_VoltageAmplifier31 (C34_U_VoltageAmplifier_1xFPGA4_U_VoltageAmplifier31.2 U9_U_VoltageAmplifier_1xFPGA4_U_VoltageAmplifier31.3 U9_U_VoltageAmplifier_1xFPGA4_U_VoltageAmplifier31.9), U_VoltageAmplifier_1xFPGA4/U_VoltageAmplifier32 (C34_U_VoltageAmplifier_1xFPGA4_U_VoltageAmplifier32.2 U9_U_VoltageAmplifier_1xFPGA4_U_VoltageAmplifier32.3 U9_U_VoltageAmplifier_1xFPGA4_U_VoltageAmplifier32.9), U_VoltageAmplifier_1xFPGA4/U_VoltageAmplifier33 (C34_U_VoltageAmplifier_1xFPGA4_U_VoltageAmplifier33.2 U9_U_VoltageAmplifier_1xFPGA4_U_VoltageAmplifier33.3 U9_U_VoltageAmplifier_1xFPGA4_U_VoltageAmplifier33.9), U_VoltageAmplifier_1xFPGA4/U_VoltageAmplifier34 (C34_U_VoltageAmplifier_1xFPGA4_U_VoltageAmplifier34.2 U9_U_VoltageAmplifier_1xFPGA4_U_VoltageAmplifier34.3 U9_U_VoltageAmplifier_1xFPGA4_U_VoltageAmplifier34.9), U_VoltageAmplifier_1xFPGA4/U_VoltageAmplifier35 (C34_U_VoltageAmplifier_1xFPGA4_U_VoltageAmplifier35.2 U9_U_VoltageAmplifier_1xFPGA4_U_VoltageAmplifier35.3 U9_U_VoltageAmplifier_1xFPGA4_U_VoltageAmplifier35.9), U_VoltageAmplifier_1xFPGA4/U_VoltageAmplifier36 (C34_U_VoltageAmplifier_1xFPGA4_U_VoltageAmplifier36.2 U9_U_VoltageAmplifier_1xFPGA4_U_VoltageAmplifier36.3 U9_U_VoltageAmplifier_1xFPGA4_U_VoltageAmplifier36.9), U_VoltageAmplifier_1xFPGA4/U_VoltageAmplifier37 (C34_U_VoltageAmplifier_1xFPGA4_U_VoltageAmplifier37.2 U9_U_VoltageAmplifier_1xFPGA4_U_VoltageAmplifier37.3 U9_U_VoltageAmplifier_1xFPGA4_U_VoltageAmplifier37.9), U_VoltageAmplifier_1xFPGA4/U_VoltageAmplifier38 (C34_U_VoltageAmplifier_1xFPGA4_U_VoltageAmplifier38.2 U9_U_VoltageAmplifier_1xFPGA4_U_VoltageAmplifier38.3 U9_U_VoltageAmplifier_1xFPGA4_U_VoltageAmplifier38.9)
PWR_CNTRL: TOP_VOLTAGE (J1.7 J1.8), Power_ORing (6 pins)
SHIELD: TOP_VOLTAGE (J1.MH1 J1.MH2), Power_ORing (J2.MH1 J2.MH2 J2.MH3 J2.MH4)
VCC_3V3: TOP_VOLTAGE (7 pins), F1/IO (C1_F1_IO.2 U1_F1_IO.1 U1_F1_IO.4), F1/POWER (L1_F1_POWER.1 L3_F1_POWER.1), POWER_VOLTAGE (5 pins), F2/IO (C1_F2_IO.2 U1_F2_IO.1 U1_F2_IO.4), F2/POWER (L1_F2_POWER.1 L3_F2_POWER.1), F3/IO (C1_F3_IO.2 U1_F3_IO.1 U1_F3_IO.4), F3/POWER (L1_F3_POWER.1 L3_F3_POWER.1), F4/IO (C1_F4_IO.2 U1_F4_IO.1 U1_F4_IO.4), F4/POWER (L1_F4_POWER.1 L3_F4_POWER.1)
VCC_12V: POWER_VOLTAGE (9 pins), Power_ORing (7 pins)